# Altium schematic sheet USB-HUB.SchDoc: USB Hub
size A4; Author: João Guimarães; Organization: Altium Limited; Address1: L3, 12a Rodborough Rd; Address2: Frenchs Forest; Address3: NSW; Address4: Australia 2086; Revision: 1.0; SheetNumber: 2; SheetTotal: 7
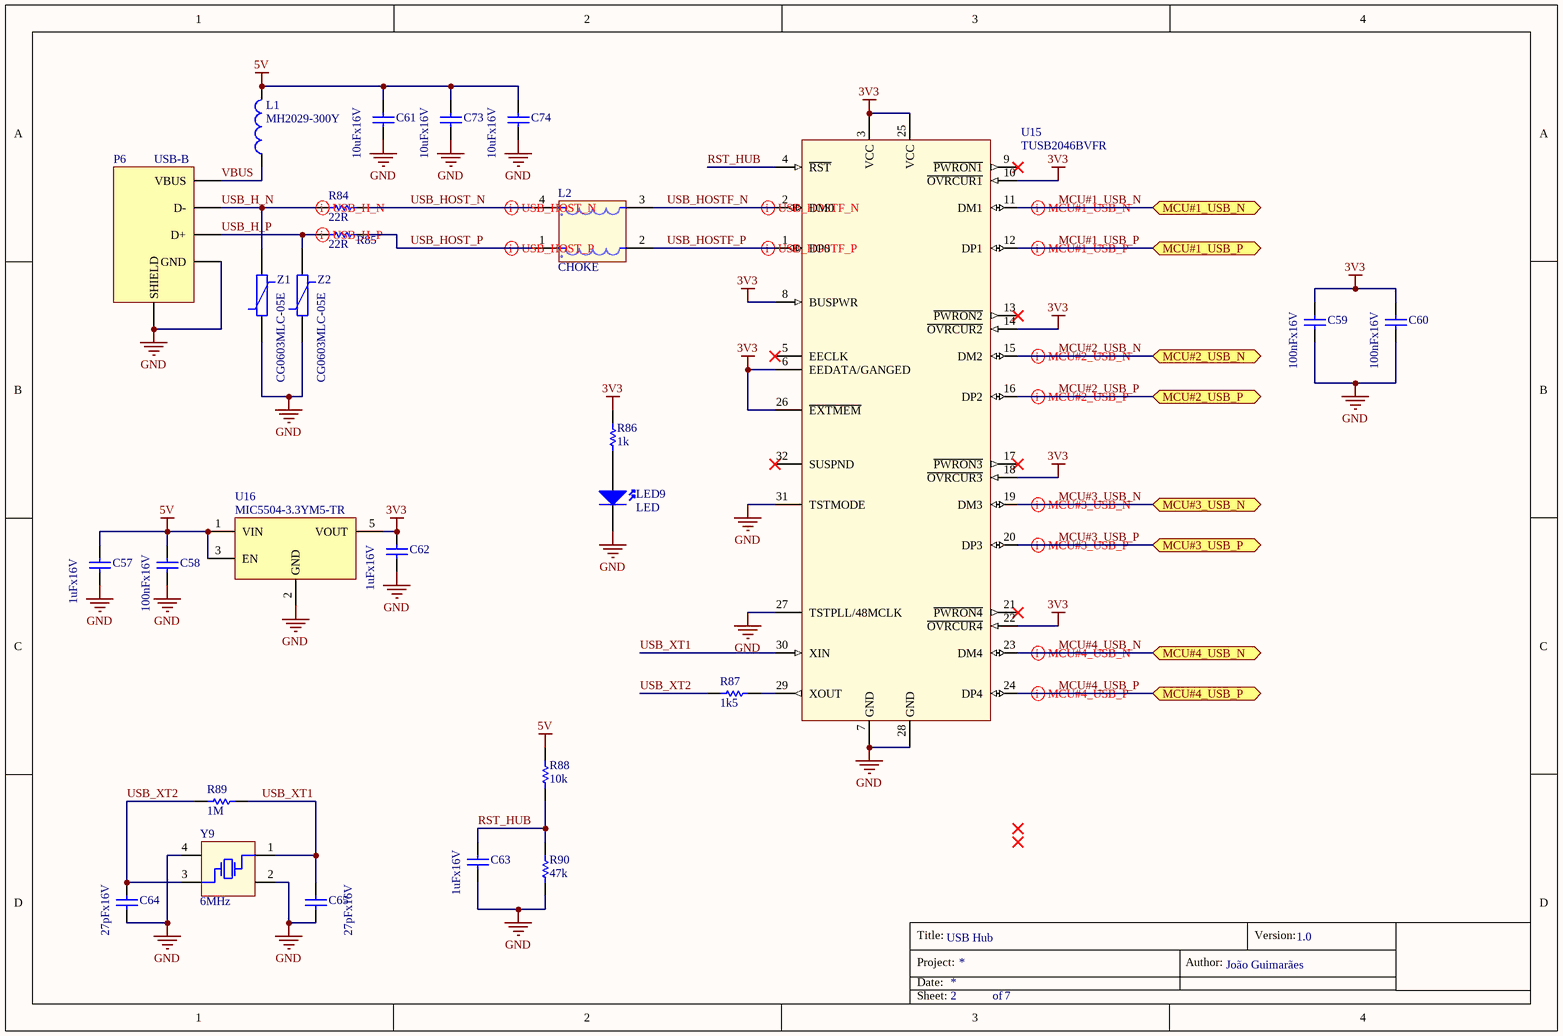
[diagram p0: USB-HUB.SchDoc]

## Parts
C57  1uFx16V  [DISC-0603]
C58  100nFx16V  [DISC-0603]
C59  100nFx16V  [DISC-0603]
C60  100nFx16V  [DISC-0603]
C61  10uFx16V  [DISC-0805]
C62  1uFx16V  [DISC-0603]
C63  1uFx16V  [DISC-0603]
C64  27pFx16V  [DISC-0603]
C65  27pFx16V  [DISC-0603]
C73  10uFx16V  [DISC-0805]
C74  10uFx16V  [DISC-0805]
L1  MH2029-300Y  [DISC-0805]
L2  CHOKE  [DISC-CHOKE-DLP11S]
LED9  LED  [DISC-LED-1206]
P6  USB-B  [CON-USB-B]
R84  22R  [DISC-0603]
R85  22R  [DISC-0603]
R86  1k  [DISC-0603]
R87  1k5  [DISC-0603]
R88  10k  [DISC-0603]
R89  1M  [DISC-0603]
R90  47k  [DISC-0603]
U15  TUSB2046BVFR  [CI-QFP-32]
U16  MIC5504-3.3YM5-TR  [CI-SOT-23-5]
Y9  6MHz  [DISC-CRYSTAL-4P-3.2X2.5]
Z1  CG0603MLC-05E  [DISC-0603]
Z2  CG0603MLC-05E  [DISC-0603]

## Ports
MCU#1_USB_N (bidir), MCU#1_USB_P (bidir), MCU#2_USB_N (bidir), MCU#2_USB_P (bidir), MCU#3_USB_N (bidir), MCU#3_USB_P (bidir), MCU#4_USB_N (bidir), MCU#4_USB_P (bidir)

## Nets
3V3: C59.1 C60.1 C62.1 R86.2 U15.3(VCC) U15.6(EEDATA/GANGED) U15.8(BUSPWR) U15.10(~{OVRCUR1}) U15.14(~{OVRCUR2}) U15.18(~{OVRCUR3}) U15.22(~{OVRCUR4}) U15.25(VCC) U15.26(~{EXTMEM}) U16.5(VOUT)
5V: C57.1 C58.1 C61.1 C73.1 C74.1 L1.2 R88.1 U16.1(VIN) U16.3(EN)
GND: C57.2 C58.2 C59.2 C60.2 C61.2 C62.2 C63.1 C64.1 C65.1 C73.2 C74.2 LED9.2(K) P6.4(GND) P6.5(SHIELD) P6.6(SHIELD) R90.2 U15.7(GND) U15.27(TSTPLL/48MCLK) U15.28(GND) U15.31(TSTMODE) U16.2(GND) Y9.2(GND) Y9.4(GND) Z1.1 Z2.1
MCU#1_USB_N: U15.11(DM1) ; port MCU#1_USB_N
MCU#1_USB_P: U15.12(DP1) ; port MCU#1_USB_P
MCU#2_USB_N: U15.15(DM2) ; port MCU#2_USB_N
MCU#2_USB_P: U15.16(DP2) ; port MCU#2_USB_P
MCU#3_USB_N: U15.19(DM3) ; port MCU#3_USB_N
MCU#3_USB_P: U15.20(DP3) ; port MCU#3_USB_P
MCU#4_USB_N: U15.23(DM4) ; port MCU#4_USB_N
MCU#4_USB_P: U15.24(DP4) ; port MCU#4_USB_P
RST_HUB: C63.2 R88.2 R90.1 U15.4(~{RST})
USB_H_N: P6.2(D-) R84.1 Z1.2
USB_H_P: P6.3(D+) R85.1 Z2.2
USB_HOST_N: L2.4 R84.2
USB_HOST_P: L2.1 R85.2
USB_HOSTF_N: L2.3 U15.2(DM0)
USB_HOSTF_P: L2.2 U15.1(DP0)
USB_XT1: C65.2 R89.2 U15.30(XIN) Y9.1(OSC1)
USB_XT2: C64.2 R87.1 R89.1 Y9.3(OSC2)
VBUS: L1.1 P6.1(VBUS)
NetLED9_1: LED9.1(A) R86.1
NetR87_2: R87.2 U15.29(XOUT)

Not connected (* = marked no-connect by the designer): U15 5(EECLK)* 9(~{PWRON1})* 13(~{PWRON2})* 17(~{PWRON3})* 21(~{PWRON4})* 32(SUSPND)*

## Layout directives
differential pair; net class USBDIF: MCU#1_USB_N, MCU#1_USB_P, MCU#2_USB_N, MCU#2_USB_P, MCU#3_USB_N, MCU#3_USB_P, MCU#4_USB_N, MCU#4_USB_P, USB_H_N, USB_H_P, USB_HOST_N, USB_HOST_P, USB_HOSTF_N, USB_HOSTF_P

## Notes on the sheet
- Title:
- Project:
- Date:
- Author:
- Version:
- Sheet:
- of

## Library data of the parts
C57-C65 C73 C74 = Cap: Capacitor
L1 = Inductor: Chip Inductor
P6 = USB Type-B
R84 R85 R87-R90 = Res: Resistor
R86 = Res
U15 = TUSB2046BVFR: TUSB2046x 4-Port Hub for the Universal Serial Bus With Optional / Serial EEPROM Interface
Y9 = XTAL-4-PIN
Z1 Z2 = Varistor